# Altium schematic sheet 13_Interface_Options.SchDoc: Configuration and Assembly Options
size 420 x 297 mm; Author: Lukas Henkel; DocumentNumber: 13; SheetNumber: 13; SheetTotal: 16; DocSize: A3
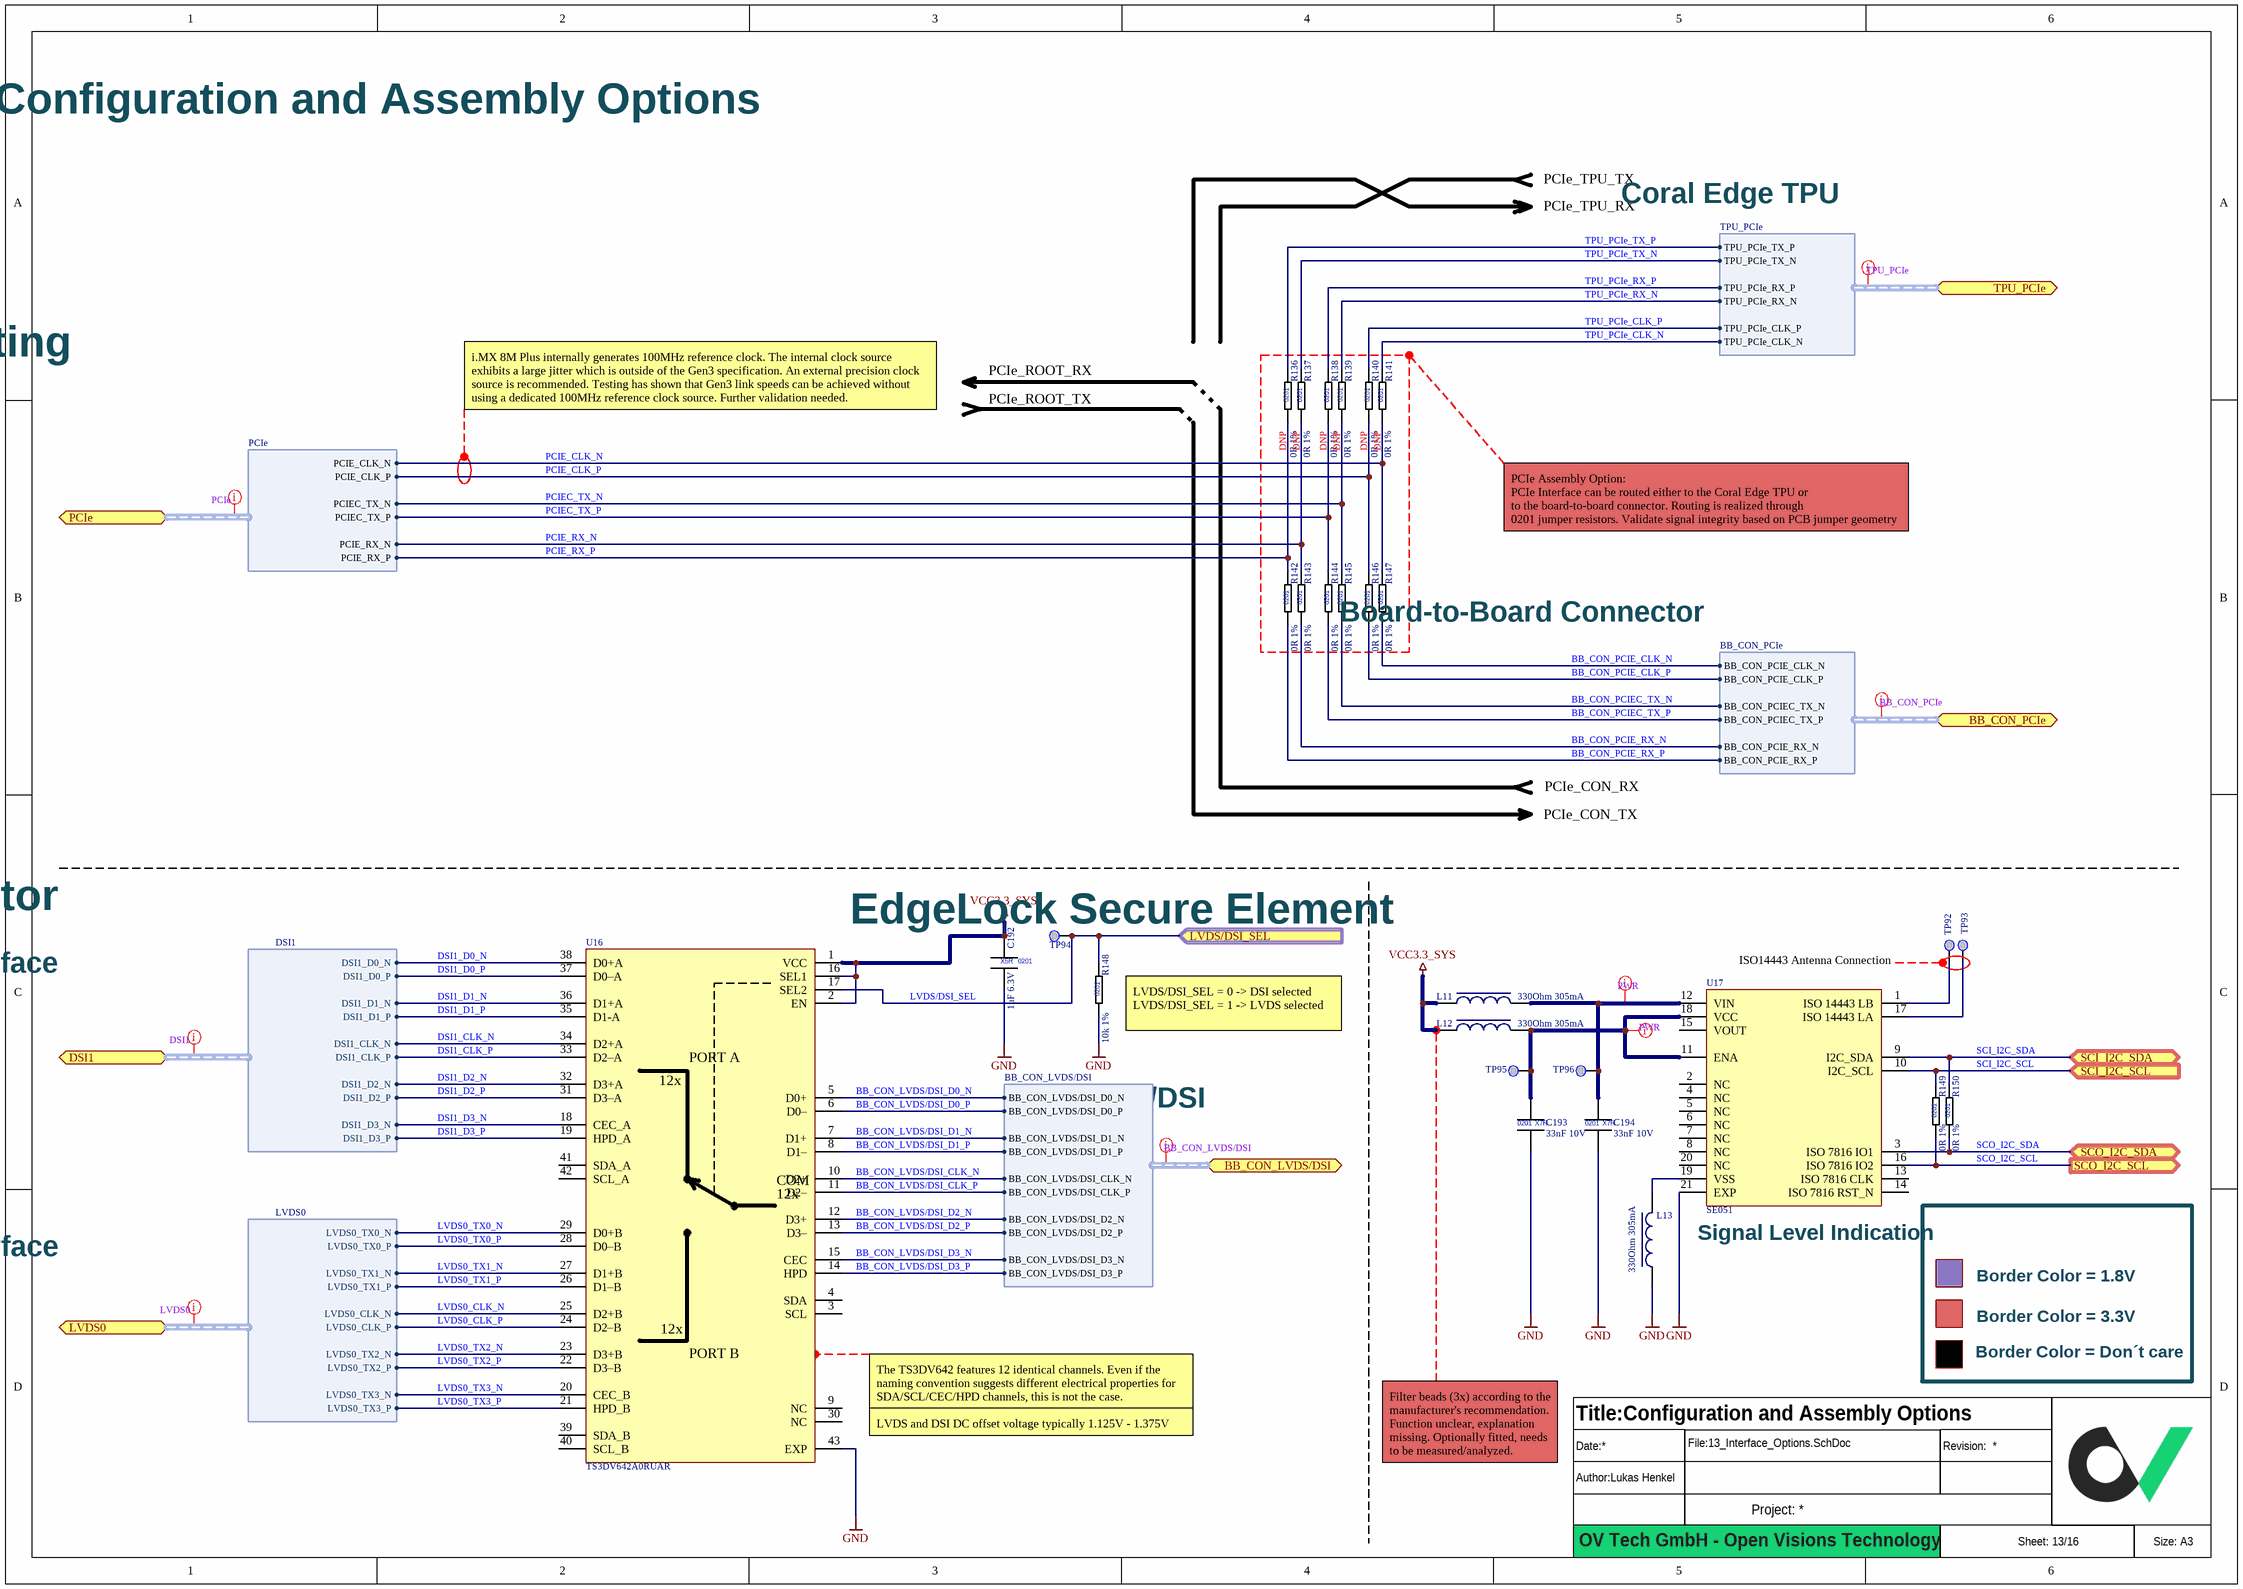
[diagram p0: 13_Interface_Options.SchDoc]

## Parts
?  (no value)  (graphical)
C192  1uF 6.3V  [CAPC0603X03L]
C193  33nF 10V  [CAPC0603X03L]
C194  33nF 10V  [CAPC0603X03L]
L11  330Ohm 305mA  [INDC0603X03L]
L12  330Ohm 305mA  [INDC0603X03L]
L13  330Ohm 305mA  [INDC0603X03L]
R136  0R 1%  [RESC0603X03L]
R137  0R 1%  [RESC0603X03L]
R138  0R 1%  [RESC0603X03L]
R139  0R 1%  [RESC0603X03L]
R140  0R 1%  [RESC0603X03L]
R141  0R 1%  [RESC0603X03L]
R142  0R 1%  [RESC0603X03L]
R143  0R 1%  [RESC0603X03L]
R144  0R 1%  [RESC0603X03L]
R145  0R 1%  [RESC0603X03L]
R146  0R 1%  [RESC0603X03L]
R147  0R 1%  [RESC0603X03L]
R148  10k 1%  [RESC0603X03L]
R149  0R 1%  [RESC0603X03L]
R150  0R 1%  [RESC0603X03L]
TP92  Testpoint 0.75mm  [TP_0.75mm]  (value not drawn)  (no BOM)
TP93  Testpoint 0.75mm  [TP_0.75mm]  (value not drawn)  (no BOM)
TP94  Testpoint 0.5mm  [TP_0.50mm]  (value not drawn)  (no BOM)
TP95  Testpoint 0.5mm  [TP_0.50mm]  (value not drawn)  (no BOM)
TP96  Testpoint 0.5mm  [TP_0.50mm]  (value not drawn)  (no BOM)
U16  TS3DV642A0RUAR  [QFN50P350X900X80_HS-43L]
U17  SE051  [QFN40P300X300X33_HS-21L]

## Ports
BB_CON_LVDS/DSI (bidir, harness BB_CON_LVDS/DSI), BB_CON_PCIe (bidir, harness BB_CON_PCIe), DSI1 (bidir, harness DSI1), LVDS0 (bidir, harness LVDS0), LVDS/DSI_SEL (in), PCIe (bidir, harness PCIe), SCI_I2C_SCL (in), SCI_I2C_SDA (bidir), SCO_I2C_SCL (out), SCO_I2C_SDA (bidir), TPU_PCIe (bidir, harness TPU_PCIe)

## Harnesses
PCIe: PCIE_CLK_N, PCIE_CLK_P, PCIEC_TX_N, PCIE_RX_P, PCIE_RX_N, PCIEC_TX_P
TPU_PCIe: TPU_PCIe_TX_P, TPU_PCIe_TX_N, TPU_PCIe_RX_P, TPU_PCIe_RX_N, TPU_PCIe_CLK_P, TPU_PCIe_CLK_N
BB_CON_PCIe: BB_CON_PCIE_CLK_N, BB_CON_PCIE_CLK_P, BB_CON_PCIEC_TX_N, BB_CON_PCIE_RX_P, BB_CON_PCIE_RX_N, BB_CON_PCIEC_TX_P
BB_CON_LVDS/DSI: BB_CON_LVDS/DSI_D0_P, BB_CON_LVDS/DSI_D0_N, BB_CON_LVDS/DSI_D1_P, BB_CON_LVDS/DSI_D1_N, BB_CON_LVDS/DSI_D2_P, BB_CON_LVDS/DSI_D2_N, BB_CON_LVDS/DSI_CLK_P, BB_CON_LVDS/DSI_CLK_N, BB_CON_LVDS/DSI_D3_P, BB_CON_LVDS/DSI_D3_N
DSI1: DSI1_CLK_N, DSI1_CLK_P, DSI1_D0_N, DSI1_D0_P, DSI1_D1_N, DSI1_D1_P, DSI1_D2_N, DSI1_D2_P, DSI1_D3_N, DSI1_D3_P
LVDS0: LVDS0_CLK_N, LVDS0_CLK_P, LVDS0_TX0_N, LVDS0_TX0_P, LVDS0_TX1_N, LVDS0_TX1_P, LVDS0_TX2_N, LVDS0_TX2_P, LVDS0_TX3_N, LVDS0_TX3_P

## Nets
GND: C192.2 C193.2 C194.2 L13.1 R148.1 U16.43(EXP) U17.21(EXP)
VCC3.3_SYS: C192.1 L11.1 L12.1 U16.1(VCC) U16.2(EN) U16.16(SEL1)
BB_CON_LVDS/DSI_CLK_N: U16.10(D2+) ; port BB_CON_LVDS/DSI.BB_CON_LVDS/DSI_CLK_N
BB_CON_LVDS/DSI_CLK_P: U16.11(D2–) ; port BB_CON_LVDS/DSI.BB_CON_LVDS/DSI_CLK_P
BB_CON_LVDS/DSI_D0_N: U16.5(D0+) ; port BB_CON_LVDS/DSI.BB_CON_LVDS/DSI_D0_N
BB_CON_LVDS/DSI_D0_P: U16.6(D0–) ; port BB_CON_LVDS/DSI.BB_CON_LVDS/DSI_D0_P
BB_CON_LVDS/DSI_D1_N: U16.7(D1+) ; port BB_CON_LVDS/DSI.BB_CON_LVDS/DSI_D1_N
BB_CON_LVDS/DSI_D1_P: U16.8(D1–) ; port BB_CON_LVDS/DSI.BB_CON_LVDS/DSI_D1_P
BB_CON_LVDS/DSI_D2_N: U16.12(D3+) ; port BB_CON_LVDS/DSI.BB_CON_LVDS/DSI_D2_N
BB_CON_LVDS/DSI_D2_P: U16.13(D3–) ; port BB_CON_LVDS/DSI.BB_CON_LVDS/DSI_D2_P
BB_CON_LVDS/DSI_D3_N: U16.15(CEC) ; port BB_CON_LVDS/DSI.BB_CON_LVDS/DSI_D3_N
BB_CON_LVDS/DSI_D3_P: U16.14(HPD) ; port BB_CON_LVDS/DSI.BB_CON_LVDS/DSI_D3_P
BB_CON_PCIE_CLK_N: R147.1 ; port BB_CON_PCIe.BB_CON_PCIE_CLK_N
BB_CON_PCIE_CLK_P: R146.1 ; port BB_CON_PCIe.BB_CON_PCIE_CLK_P
BB_CON_PCIE_RX_N: R143.1 ; port BB_CON_PCIe.BB_CON_PCIE_RX_N
BB_CON_PCIE_RX_P: R142.1 ; port BB_CON_PCIe.BB_CON_PCIE_RX_P
BB_CON_PCIEC_TX_N: R145.1 ; port BB_CON_PCIe.BB_CON_PCIEC_TX_N
BB_CON_PCIEC_TX_P: R144.1 ; port BB_CON_PCIe.BB_CON_PCIEC_TX_P
DSI1_CLK_N: U16.34(D2+A) ; port DSI1.DSI1_CLK_N
DSI1_CLK_P: U16.33(D2–A) ; port DSI1.DSI1_CLK_P
DSI1_D0_N: U16.38(D0+A) ; port DSI1.DSI1_D0_N
DSI1_D0_P: U16.37(D0–A) ; port DSI1.DSI1_D0_P
DSI1_D1_N: U16.36(D1+A) ; port DSI1.DSI1_D1_N
DSI1_D1_P: U16.35(D1-A) ; port DSI1.DSI1_D1_P
DSI1_D2_N: U16.32(D3+A) ; port DSI1.DSI1_D2_N
DSI1_D2_P: U16.31(D3–A) ; port DSI1.DSI1_D2_P
DSI1_D3_N: U16.18(CEC_A) ; port DSI1.DSI1_D3_N
DSI1_D3_P: U16.19(HPD_A) ; port DSI1.DSI1_D3_P
LVDS0_CLK_N: U16.25(D2+B) ; port LVDS0.LVDS0_CLK_N
LVDS0_CLK_P: U16.24(D2–B) ; port LVDS0.LVDS0_CLK_P
LVDS0_TX0_N: U16.29(D0+B) ; port LVDS0.LVDS0_TX0_N
LVDS0_TX0_P: U16.28(D0–B) ; port LVDS0.LVDS0_TX0_P
LVDS0_TX1_N: U16.27(D1+B) ; port LVDS0.LVDS0_TX1_N
LVDS0_TX1_P: U16.26(D1–B) ; port LVDS0.LVDS0_TX1_P
LVDS0_TX2_N: U16.23(D3+B) ; port LVDS0.LVDS0_TX2_N
LVDS0_TX2_P: U16.22(D3–B) ; port LVDS0.LVDS0_TX2_P
LVDS0_TX3_N: U16.20(CEC_B) ; port LVDS0.LVDS0_TX3_N
LVDS0_TX3_P: U16.21(HPD_B) ; port LVDS0.LVDS0_TX3_P
LVDS/DSI_SEL: R148.2 TP94.TP U16.17(SEL2) ; port LVDS/DSI_SEL
PCIE_CLK_N: R141.1 R147.2 ; port PCIe.PCIE_CLK_N
PCIE_CLK_P: R140.1 R146.2 ; port PCIe.PCIE_CLK_P
PCIE_RX_N: R137.1 R143.2 ; port PCIe.PCIE_RX_N
PCIE_RX_P: R136.1 R142.2 ; port PCIe.PCIE_RX_P
PCIEC_TX_N: R139.1 R145.2 ; port PCIe.PCIEC_TX_N
PCIEC_TX_P: R138.1 R144.2 ; port PCIe.PCIEC_TX_P
SCI_I2C_SCL: R149.2 U17.10(I2C_SCL) ; port SCI_I2C_SCL
SCI_I2C_SDA: R150.2 U17.9(I2C_SDA) ; port SCI_I2C_SDA
SCO_I2C_SCL: R149.1 U17.16(ISO_7816_IO2) ; port SCO_I2C_SCL
SCO_I2C_SDA: R150.1 U17.3(ISO_7816_IO1) ; port SCO_I2C_SDA
TPU_PCIe_CLK_N: R141.2 ; port TPU_PCIe.TPU_PCIe_CLK_N
TPU_PCIe_CLK_P: R140.2 ; port TPU_PCIe.TPU_PCIe_CLK_P
TPU_PCIe_RX_N: R139.2 ; port TPU_PCIe.TPU_PCIe_RX_N
TPU_PCIe_RX_P: R138.2 ; port TPU_PCIe.TPU_PCIe_RX_P
TPU_PCIe_TX_N: R137.2 ; port TPU_PCIe.TPU_PCIe_TX_N
TPU_PCIe_TX_P: R136.2 ; port TPU_PCIe.TPU_PCIe_TX_P
NetC193_1: C193.1 L12.2 TP95.TP U17.11(ENA) U17.18(VCC)
NetC194_1: C194.1 L11.2 TP96.TP U17.12(VIN)
NetL13_2: L13.2 U17.19(VSS)
NetTP92_TP: TP92.TP U17.1(ISO_14443_LB)
NetTP93_TP: TP93.TP U17.17(ISO_14443_LA)

Not connected (* = marked no-connect by the designer): U16 3(SCL) 4(SDA) 9(NC) 30(NC) 39(SDA_B) 40(SCL_B) 41(SDA_A) 42(SCL_A); U17 2(NC) 4(NC) 5(NC) 6(NC) 7(NC) 8(NC) 13(ISO_7816_CLK) 14(ISO_7816_RST_N) 15(VOUT) 20(NC)

## Layout directives
net class PCIe: (no net found under the mark)
net class TPU_PCIe: (no net found under the mark)
net class BB_CON_PCIe: (no net found under the mark)
net class BB_CON_LVDS/DSI: (no net found under the mark)
net class DSI1: (no net found under the mark)
net class LVDS0: (no net found under the mark)
net class PWR: NetC193_1, NetC194_1

## Notes on the sheet
- Configuration and Assembly Options
- PCIe_TPU_TX
- Coral Edge TPU
- PCIe_TPU_RX
- PCIe routing
- PCIe_ROOT_RX
- i.MX 8M Plus internally generates 100MHz reference clock. The internal clock source exhibits a large jitter which is outside of the Gen3 specification. An external precision clock source is recommended. Testing has shown that Gen3 link speeds can be achieved without using a dedicated 100MHz reference clock source. Further validation needed.
- PCIe_ROOT_TX
- (near R136) DNP
- DNP
- (near R138) DNP
- (near R140) DNP
- PCIe Assembly Option:
  PCIe Interface can be routed either to the Coral Edge TPU or
  to the board-to-board connector. Routing is realized through
  0201 jumper resistors. Validate signal integrity based on PCB jumper geometry
- Board-to-Board Connector
- PCIe_CON_RX
- PCIe_CON_TX
- LVDS or DSI Selector
- EdgeLock Secure Element
- DSI Interface
- ISO14443 Antenna Connection
- (near R148) LVDS/DSI_SEL = 0 -> DSI selected
  LVDS/DSI_SEL = 1 -> LVDS selected
- LVDS/DSI
- LVDS Interface
- Signal Level Indication
- Border Color = 1.8V
- Border Color = 3.3V
- The TS3DV642 features 12 identical channels. Even if the naming convention suggests different electrical properties for SDA/SCL/CEC/HPD channels, this is not the case.
- Border Color = Don´t care
- LVDS and DSI DC offset voltage typically 1.125V - 1.375V
- Filter beads (3x) according to the manufacturer's recommendation. Function unclear, explanation missing. Optionally fitted, needs to be measured/analyzed.
- OV Tech GmbH - Open Visions Technology
- (in symbol CAP_0201_1uF_6.3V) X5R; 0201
- (in symbol CAP_0201_33nF_10V) 0201; X7R
- (in symbol High Speed MUX 12x1:2_TS3DV642A0RUAR) PORT A; 12x; COM; PORT B
- (in symbol RES_0201_0R_1%) 0201
- (in symbol RES_0201_10k_1%) 0201

## Library data of the parts
? = Titleblock_01_OpenSource
C192 = CAP_0201_1uF_6.3V: Multilayer Ceramic Capacitors MLCC - SMD/SMT 0201 6.3VDC; Manufacturer 1: Murata Electronics; Manufacturer 1 Prt. Nr.: GRM033R60J105MEA2D; Manufacturer 2 Prt. Nr.: CL03A105MQ3CSNC; Manufacturer 2: Samsung Electro-Mechanics
C193 C194 = CAP_0201_33nF_10V: Multilayer Ceramic Capacitors MLCC - SMD/SMT 0201 10VDC; Manufacturer 1: Murata Electronics; Manufacturer 1 Prt. Nr.: GRM033R61A333KE84E; Manufacturer 2 Prt. Nr.: CC0201KRX5R6BB333; Manufacturer 2: YAGEO
L11-L13 = BEAD_0201_330Ohm_305mA: Ferrite Bead 0201 330Ohm 305mA; Manufacturer 1 Prt. Nr.: NFZ03SG331SN10D; Manufacturer 1: Murata Electronics
R136-R147 R149 R150 = RES_0201_0R_1%: Thick Film Resistors - SMD 0R OHM 1%; Manufacturer 1: Yageo; Manufacturer 1 Prt. Nr.: RC0201FR-070RL; Manufacturer 2 Prt. Nr.: CRCW02010000Z0ED; Manufacturer 2: Vishay / Dale
R148 = RES_0201_10k_1%: Thick Film Resistors - SMD 10K OHM 1%; Manufacturer 1: Yageo; Manufacturer 1 Prt. Nr.: RC0201FR-0710KL; Manufacturer 2 Prt. Nr.: CRCW020110K0FNED; Manufacturer 2: Vishay / Dale
U16 = High Speed MUX 12x1:2_TS3DV642A0RUAR: High-speed differential switch 12x2:1 for TMDS and generel LVDS signal switching; Manufacturer 1: Texas Instruments; Manufacturer 1 Prt. Nr.: TS3DV642A0RUAR
U17 = Secure Element I2C_SE051: Secure Element Plug & Trust SE051; Manufacturer 1: NXP Semiconductors; Manufacturer 1 Prt. Nr.: SE051C2HQ1/Z01XDZ